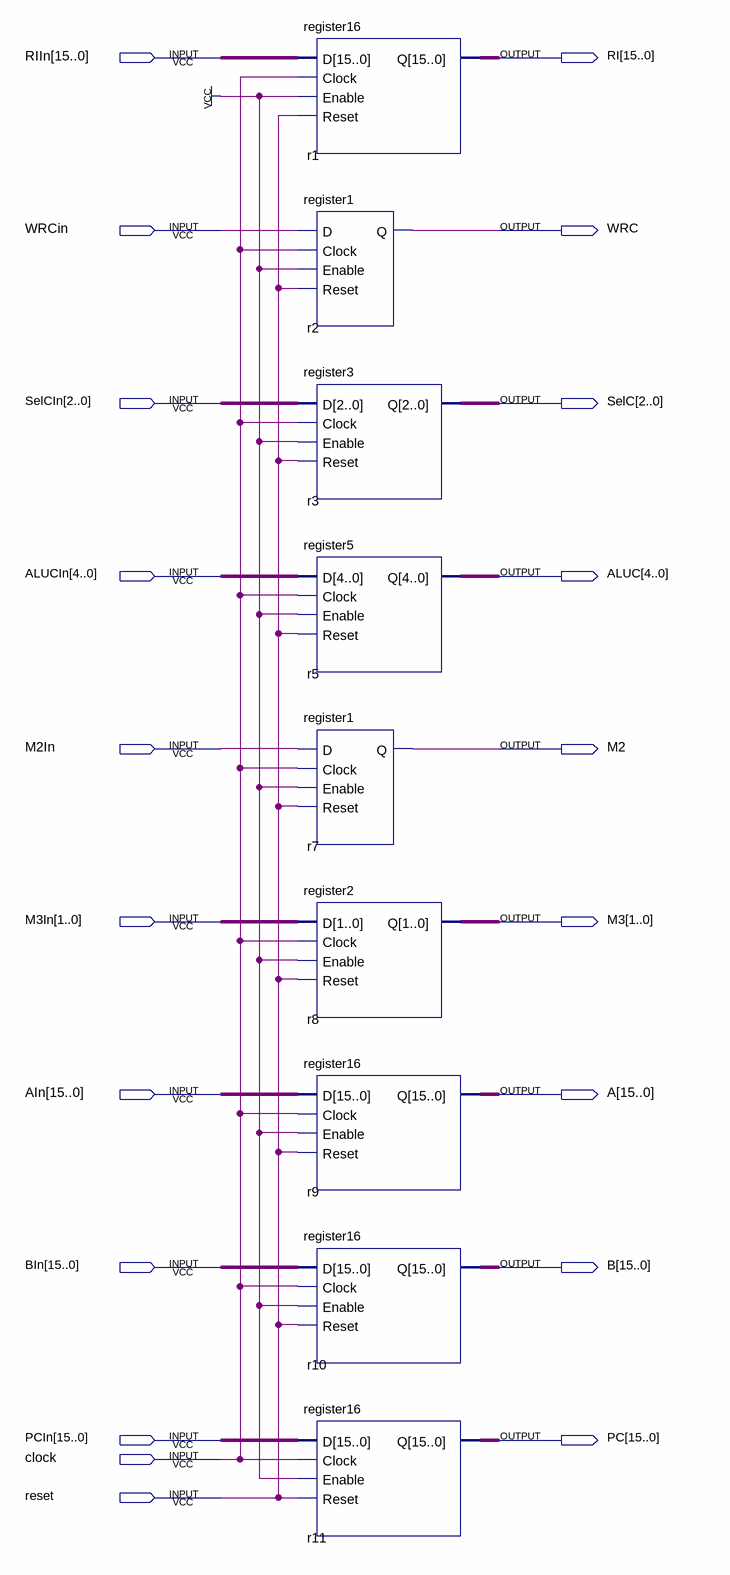
[diagram p0: schematic sheet]
// Quartus schematic pipeline2.bdf as structural Verilog: 9 symbols, 20 pins
module pipeline2 (
  input  [15:0] RIIn,
  input  WRCin,
  input  [2:0] SelCIn,
  input  [4:0] ALUCIn,
  input  M2In,
  input  [1:0] M3In,
  input  [15:0] AIn,
  input  [15:0] BIn,
  input  [15:0] PCIn,
  input  clock,
  input  reset,
  output [15:0] RI,
  output WRC,
  output [2:0] SelC,
  output [4:0] ALUC,
  output M2,
  output [1:0] M3,
  output [15:0] A,
  output [15:0] B,
  output [15:0] PC
);

  register16 r1 (.D(RIIn), .Clock(clock), .Enable(1'b1), .Reset(reset), .Q(RI));
  register1 r2 (.D(WRCin), .Clock(clock), .Enable(1'b1), .Reset(reset), .Q(WRC));
  register3 r3 (.D(SelCIn), .Clock(clock), .Enable(1'b1), .Reset(reset), .Q(SelC));
  register5 r5 (.D(ALUCIn), .Clock(clock), .Enable(1'b1), .Reset(reset), .Q(ALUC));
  register1 r7 (.D(M2In), .Clock(clock), .Enable(1'b1), .Reset(reset), .Q(M2));
  register2 r8 (.D(M3In), .Clock(clock), .Enable(1'b1), .Reset(reset), .Q(M3));
  register16 r9 (.D(AIn), .Clock(clock), .Enable(1'b1), .Reset(reset), .Q(A));
  register16 r10 (.D(BIn), .Clock(clock), .Enable(1'b1), .Reset(reset), .Q(B));
  register16 r11 (.D(PCIn), .Clock(clock), .Enable(1'b1), .Reset(reset), .Q(PC));
endmodule
